# EAGLE design cameraCableBoard (EAGLE 9.4.2)
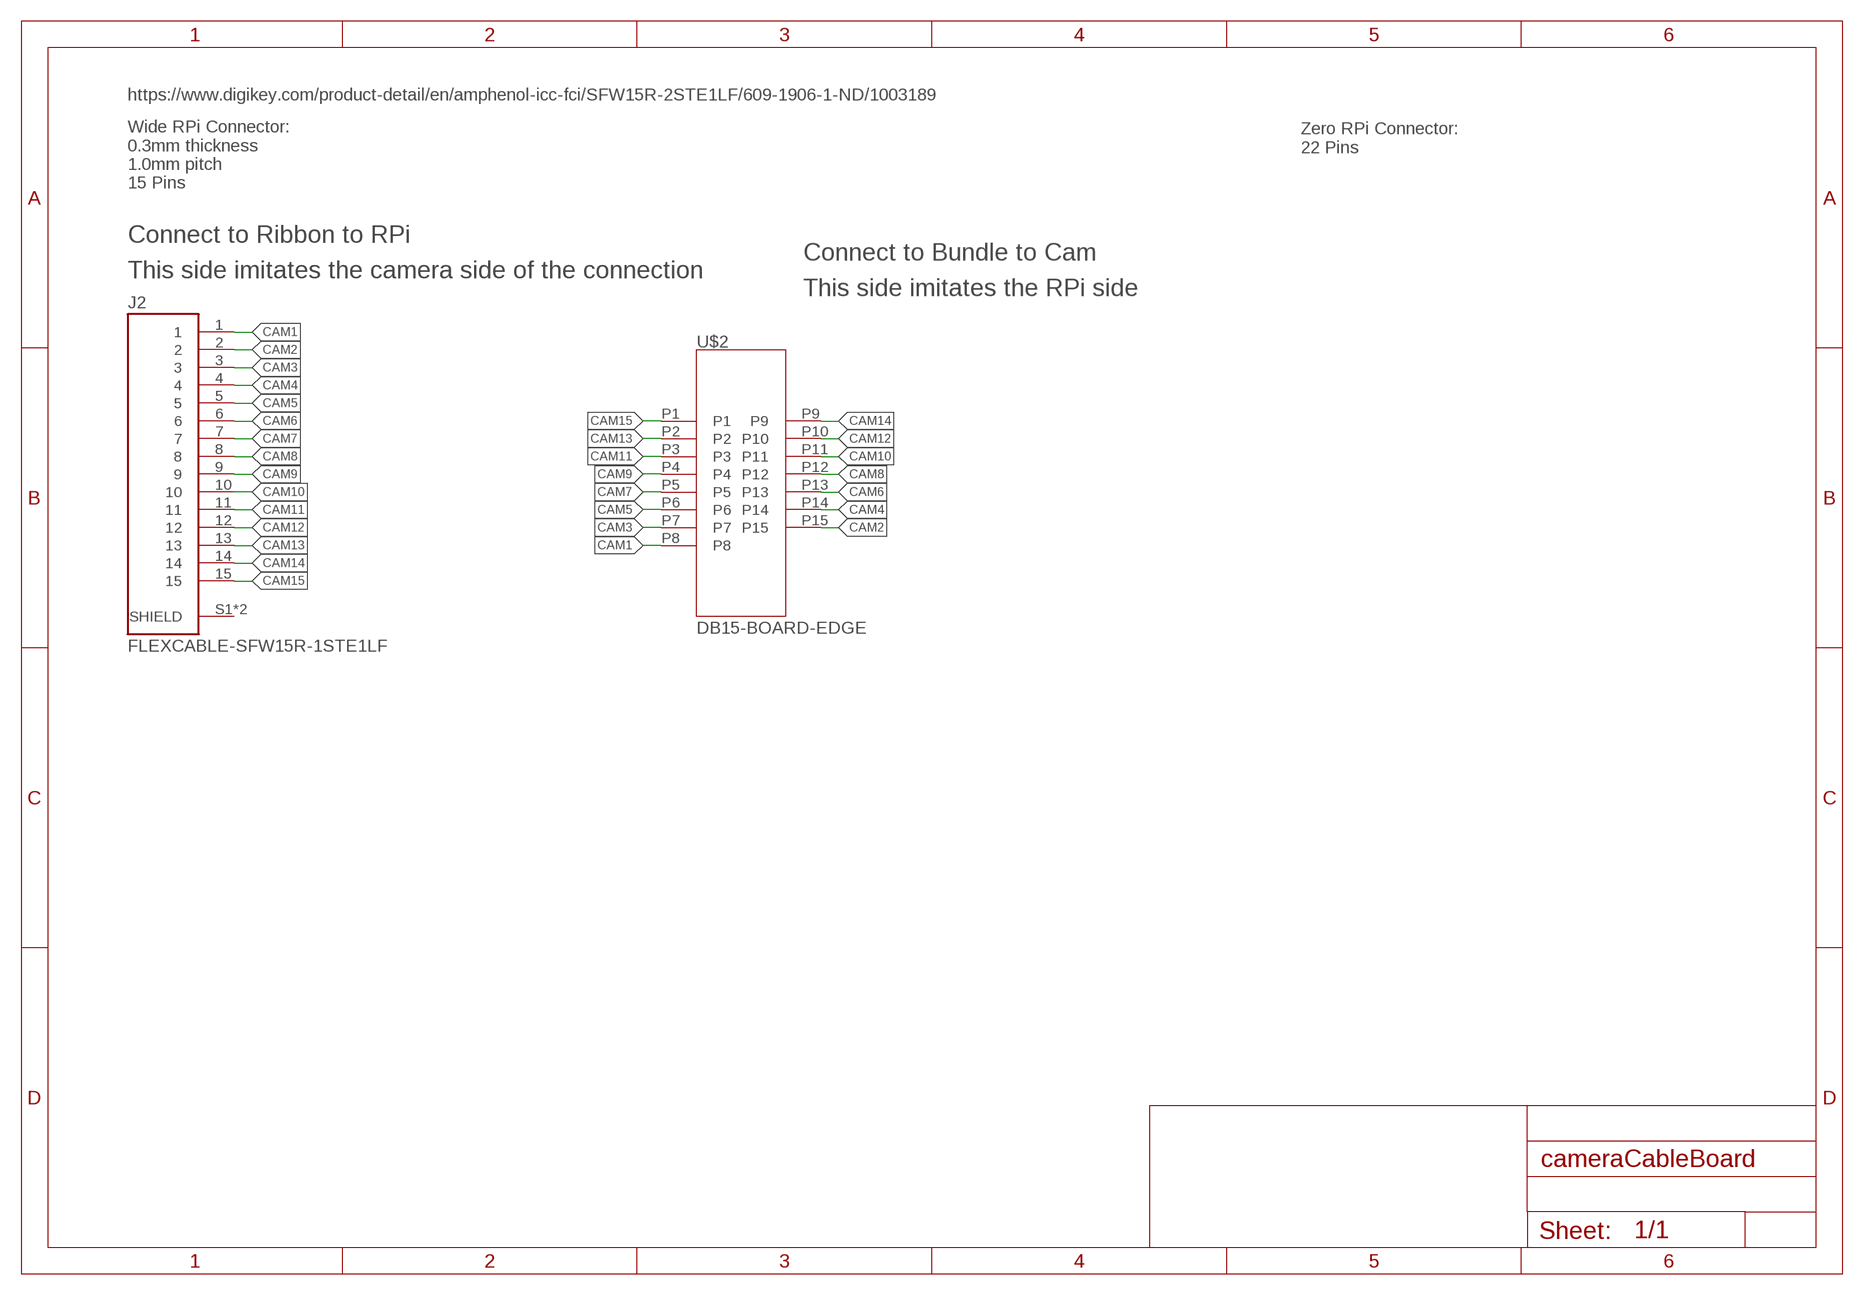
[diagram p0: schematic, sheet 1]

## Parts
J2  FLEXCABLE-SFW15R-1STE1LF  [AMPHENOL_SFW15R-1STE1LF]
U$2  DB15-BOARD-EDGE  [DB15-BOARD-EDGE]

## Nets
CAM1: J2.1 U$2.P8
CAM2: J2.2 U$2.P15
CAM3: J2.3 U$2.P7
CAM4: J2.4 U$2.P14
CAM5: J2.5 U$2.P6
CAM6: J2.6 U$2.P13
CAM7: J2.7 U$2.P5
CAM8: J2.8 U$2.P12
CAM9: J2.9 U$2.P4
CAM10: J2.10 U$2.P11
CAM11: J2.11 U$2.P3
CAM12: J2.12 U$2.P10
CAM13: J2.13 U$2.P2
CAM14: J2.14 U$2.P9
CAM15: J2.15 U$2.P1
Unconnected: J2.S1(SHIELD) J2.S2(SHIELD)

## Notes on the sheet
- https://www.digikey.com/product-detail/en/amphenol-icc-fci/SFW15R-2STE1LF/609-1906-1-ND/1003189
- Zero RPi Connector:
  22 Pins
- Wide RPi Connector:
  0.3mm thickness
  1.0mm pitch
  15 Pins
- Connect to Ribbon to RPi
- Connect to Bundle to Cam
- This side imitates the camera side of the connection
- This side imitates the RPi side

## Library data of the parts
J2 = RPi-Parts:FLEXCABLE-SFW15R-1STE1LF: Conn FFC/FPC Connector SKT 15 POS 1mm Solder RA SMD Embossed T/R; DESCRIPTION: 15 Position FFC, FPC Connector Contacts, Bottom 0.039 _1.00mm_ Surface Mount, Right Angle; DIGI-KEY_PART_NUMBER: 609-1905-1-ND; DIGI-KEY_PURCHASE_URL: https://www.digikey.com/product-detail/en/amphenol-icc-fci/SFW15R-1STE1LF/609-1905-1-ND/1003188?utm_source=snapeda&utm_medium=aggregator&utm_campaign=symbol; MF: Amphenol ICC; MP: SFW15R-1STE1LF; PACKAGE: None
U$2 = RPi-Parts:DB15-BOARD-EDGE

## Board
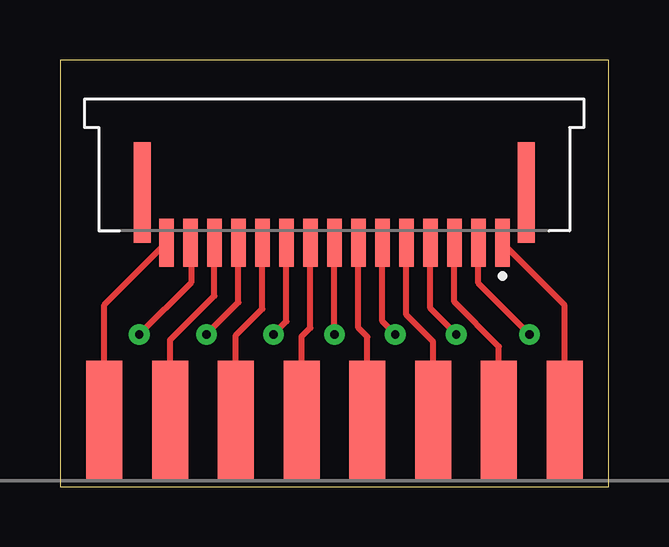
[diagram p1: board, top side]
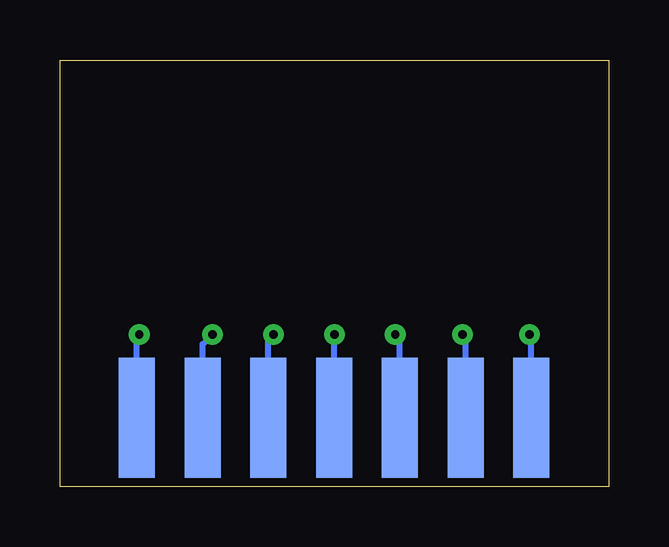
[diagram p2: board, bottom side, seen from below]

Size 22.86 x 17.78 mm. Coordinates in mm from the lower left corner, seen from the top.
Outline: 0,0 22.86,0 22.86,17.78 0,17.78 0,0
Copper layers (1*16): Top 0.035mm / dielectric 1.5mm / Bottom 0.035mm
Design rules "SparkFun-2-layer-STANDARD_13milDrill": minimum track width 10mil, minimum drill 13mil, track to track 10mil, track to pad 8mil, pad to pad 8mil, via to via 10mil, smd to smd 8mil, copper to edge 8mil, drill to drill 8mil, minimum pad ring 10mil, minimum via ring 10mil, stop-mask expansion 4mil, vias tented up to drill 25mil, thermal gap 10mil

### Footprints (pad centres in the part's own frame; a part is rotated, then mirrored left to right if it is on the bottom)
AMPHENOL_SFW15R-1STE1LF = smd 0.6 x 2: 1 -7,0; 2 -6,0; 3 -5,0; 4 -4,0; 5 -3,0; 6 -2,0; 7 -1,0; 8 0,0; 9 1,0; 10 2,0; 11 3,0; 12 4,0; 13 5,0; 14 6,0; 15 7,0 | smd 0.7 x 4.2: S1 -8,-2.1; S2 8,-2.1
DB15-BOARD-EDGE = smd 1.5 x 5: P1 9.58,-2.5; P2 6.84,-2.5; P3 4.1,-2.5; P4 1.36,-2.5; P5 -1.38,-2.5; P6 -4.12,-2.5; P7 -6.86,-2.5; P8 -9.6,-2.5 | smd 1.5 x 5 bottom: P9 8.21,-2.61; P10 5.47,-2.61; P11 2.73,-2.61; P12 -0.01,-2.61; P13 -2.75,-2.61; P14 -5.49,-2.61; P15 -8.23,-2.61

### Placement (x,y rotation side)
J2  11.43,10.16 180 top
U$2  11.43,0.25 180 top

### Tracks (layer width: path | path; a pad name or v marks a point on that pad's centre or on a via)
CAM1
  Top 0.254: U$2.P8 21.03,7.56 J2.1
CAM2  (via drill 0.35)
  Top 0.254: v19.56,6.35 17.43,8.48 J2.2
  Bottom 0.254: U$2.P15 19.66,6.25 v19.56,6.35
CAM3
  Top 0.254: U$2.P7 18.29,5.84 16.43,7.7 J2.3
CAM4  (via drill 0.35)
  Top 0.254: v16.51,6.35 15.43,7.43 J2.4
  Bottom 0.254: U$2.P14 16.92,5.94 v16.51,6.35
CAM5
  Top 0.254: U$2.P6 15.55,6.04 14.43,7.16 J2.5
CAM6  (via drill 0.35)
  Top 0.254: v13.97,6.35 13.43,6.89 J2.6
  Bottom 0.254: U$2.P13 14.18,6.14 v13.97,6.35
CAM7
  Top 0.254: U$2.P5 12.81,6.24 12.43,6.62 J2.7
CAM8  (via drill 0.35)
  Top 0.254: v11.43,6.35 J2.8
  Bottom 0.254: U$2.P12 v11.44,6.34 v11.43,6.35
CAM9
  Top 0.254: U$2.P4 10.07,6.26 10.43,6.62 J2.9
CAM10  (via drill 0.35)
  Top 0.254: v8.89,6.35 9.43,6.89 J2.10
  Bottom 0.254: U$2.P11 8.7,6.16 v8.89,6.35
CAM11
  Top 0.254: U$2.P3 7.33,6.31 8.43,7.41 J2.11
CAM12  (via drill 0.35)
  Top 0.254: v6.1,6.35 7.43,7.68 J2.12
  Bottom 0.254: U$2.P10 5.96,6.21 v6.1,6.35
CAM13
  Top 0.254: U$2.P2 4.59,6.11 6.43,7.95 J2.13
CAM14  (via drill 0.35)
  Top 0.254: v3.3,6.35 5.46,8.51 5.46,10.13 J2.14
  Bottom 0.254: U$2.P9 3.22,6.27 v3.3,6.35
CAM15
  Top 0.254: U$2.P1 1.85,7.58 J2.15

### Text on the board
tDocu: Estimated Clock Skew: 3.8picoseconds